# Altium project commutation.PrjPCB
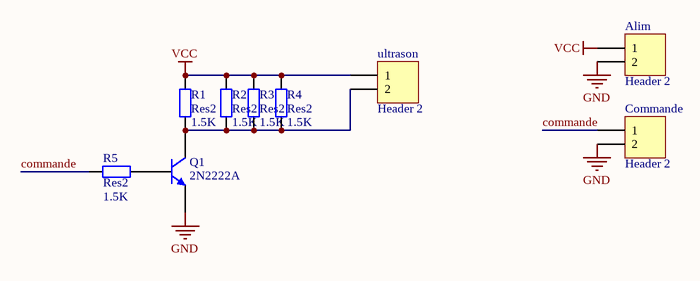
[diagram p0: Sheet1.SchDoc]
1 sheet, 9 parts. Net scope: global (net labels, ports and power ports of the same name join across sheets).
Board file: pcb_commutation.PcbDoc

## Sheet Sheet1.SchDoc
size A4

### Parts
Alim  Header 2  [HDR1X2]
Commande  Header 2  [HDR1X2]
Q1  2N2222A  [TO-18]
R1  Res2  value 1.5K  [AXIAL-0.4]
R2  Res2  value 1.5K  [AXIAL-0.4]
R3  Res2  value 1.5K  [AXIAL-0.4]
R4  Res2  value 1.5K  [AXIAL-0.4]
R5  Res2  value 1.5K  [AXIAL-0.4]
ultrason  Header 2  [HDR1X2]

### Nets
GND: Alim.2 Commande.2 Q1.3(E)
VCC: Alim.1 R1.2 R2.2 R3.2 R4.2 ultrason.1
commande: Commande.1 R5.2
NetQ1_1: Q1.1(B) R5.1
NetQ1_2: Q1.2(C) R1.1 R2.1 R3.1 R4.1 ultrason.2

### Library data of the parts
Alim Commande ultrason = Header 2: Header, 2-Pin; LatestRevisionDate: 17-Jul-2002; LatestRevisionNote: Re-released for DXP Platform.; Publisher: Altium Limited
Q1 = 2N2222A: High Speed Switches; Published: 8-Jun-2000; LatestRevisionDate: 11-Dec-2002; LatestRevisionNote: Sim Port Map correction; DatasheetVersion: Jun-1999; PackageReference: TO-18; Publisher: Altium Limited; PackageDescription: Can; 3 Leads; Pin Circle Dia. 2.54 mm; Lead Dia. 0.49 mm (max); ComponentLink1Description: Manufacturer Link; ComponentLink1URL: http://www.st.com/; ComponentLink2Description: Datasheet; ComponentLink2URL: http://www.st.com/stonline/products/literature/ds/9288/2n2219a.pdf
R1-R5 = Res2: Resistor; Published: 8-Jun-2000; LatestRevisionDate: 17-Jul-2002; LatestRevisionNote: Re-released for DXP Platform.; PackageReference: AXIAL-0.4; Publisher: Altium Limited; PackageDescription: Axial Device, Thru-Hole; 2 Leads; 0.4 in Pin Spacing